# Altium schematic sheet Overview.SchDoc
size A; SheetNumber: 1; SheetTotal: 4
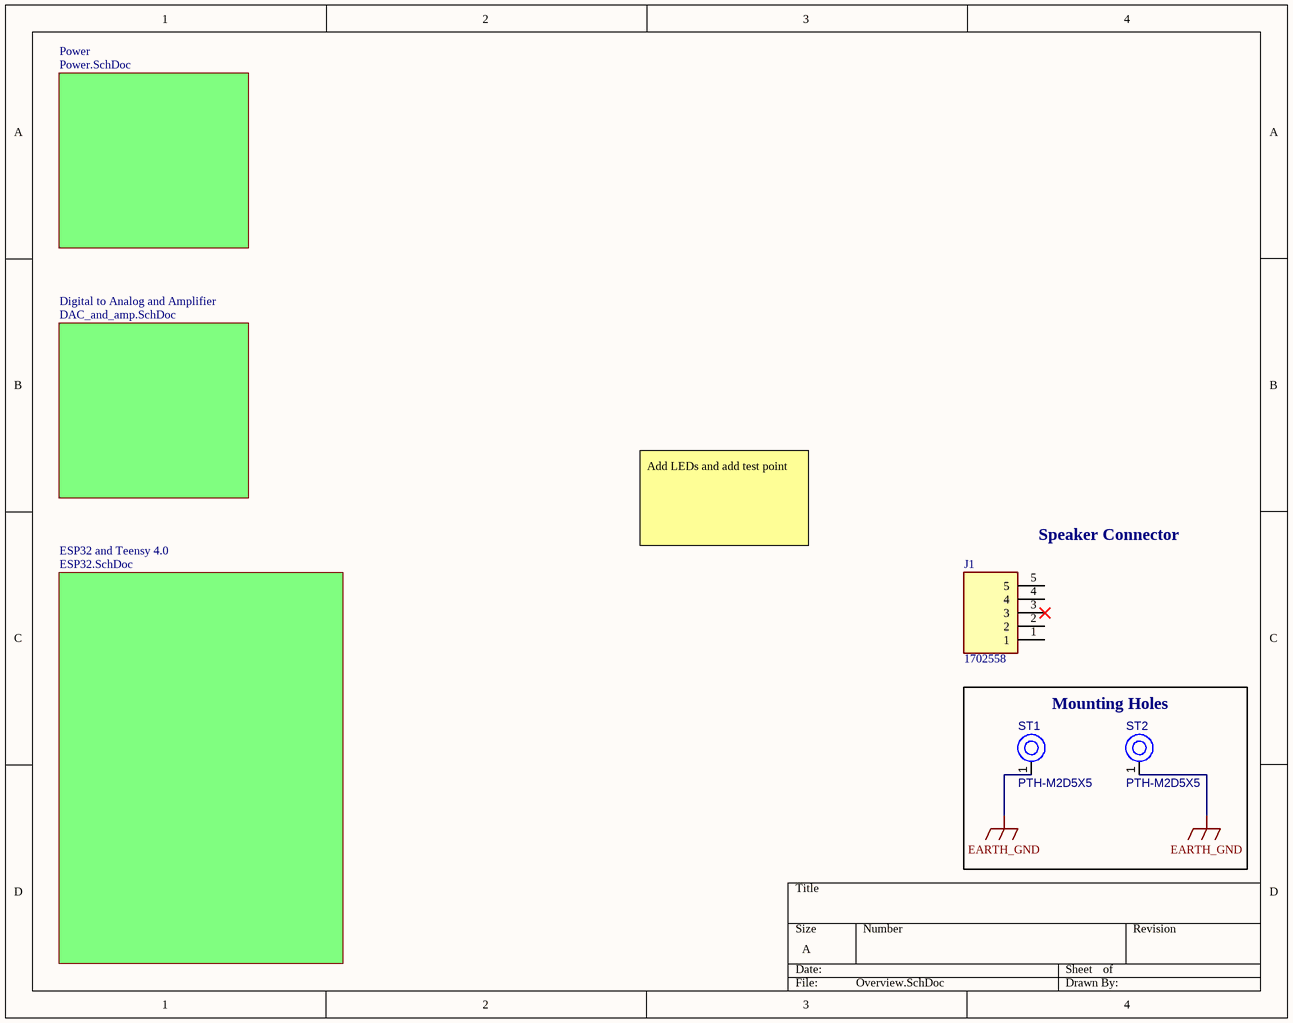
[diagram p0: Overview.SchDoc]

## Parts
J1  1702558  [1702558]
ST1  PTH-M2D5X5  [PTH-M2D5X5]
ST2  PTH-M2D5X5  [PTH-M2D5X5]

## Blocks framed on the sheet
Mounting Holes: ST1 ST2

## Sub-sheets
Digital to Analog and Amplifier = DAC_and_amp.SchDoc: no entries
ESP32 and Teensy 4.0 = ESP32.SchDoc: no entries
Power = Power.SchDoc: no entries

## Nets
EARTH_GND: ST1.1(H1) ST2.1(H1)

Not connected (* = marked no-connect by the designer): J1 1 2 3* 4 5

## Notes on the sheet
- Add LEDs and add test point
- (near J1) Speaker Connector

## Library data of the parts
J1 = 1702558: Connector; Manufacturer_Name: Phoenix Contact; Datasheet Link: http://www.phoenixcontact.com/product/1702558; Height: 19.6mm; Manufacturer_Part_Number: 1702558; Mouser Part Number: 651-1702558; Mouser Price/Stock: https://www.mouser.co.uk/ProductDetail/Phoenix-Contact/1702558?qs=bX1%252BNvsK%2FBqLrAYKddEg%2FA%3D%3D; Arrow Part Number: 1702558; Arrow Price/Stock: https://www.arrow.com/en/products/1702558/phoenix-contact?utm_currency=USD&region=nac
ST1 ST2 = CMP-00028-00004-2: M2 PTH (2.5mm), 5mm pad; Pins: 1